# EAGLE design Hauptplatine (EAGLE 5.09)
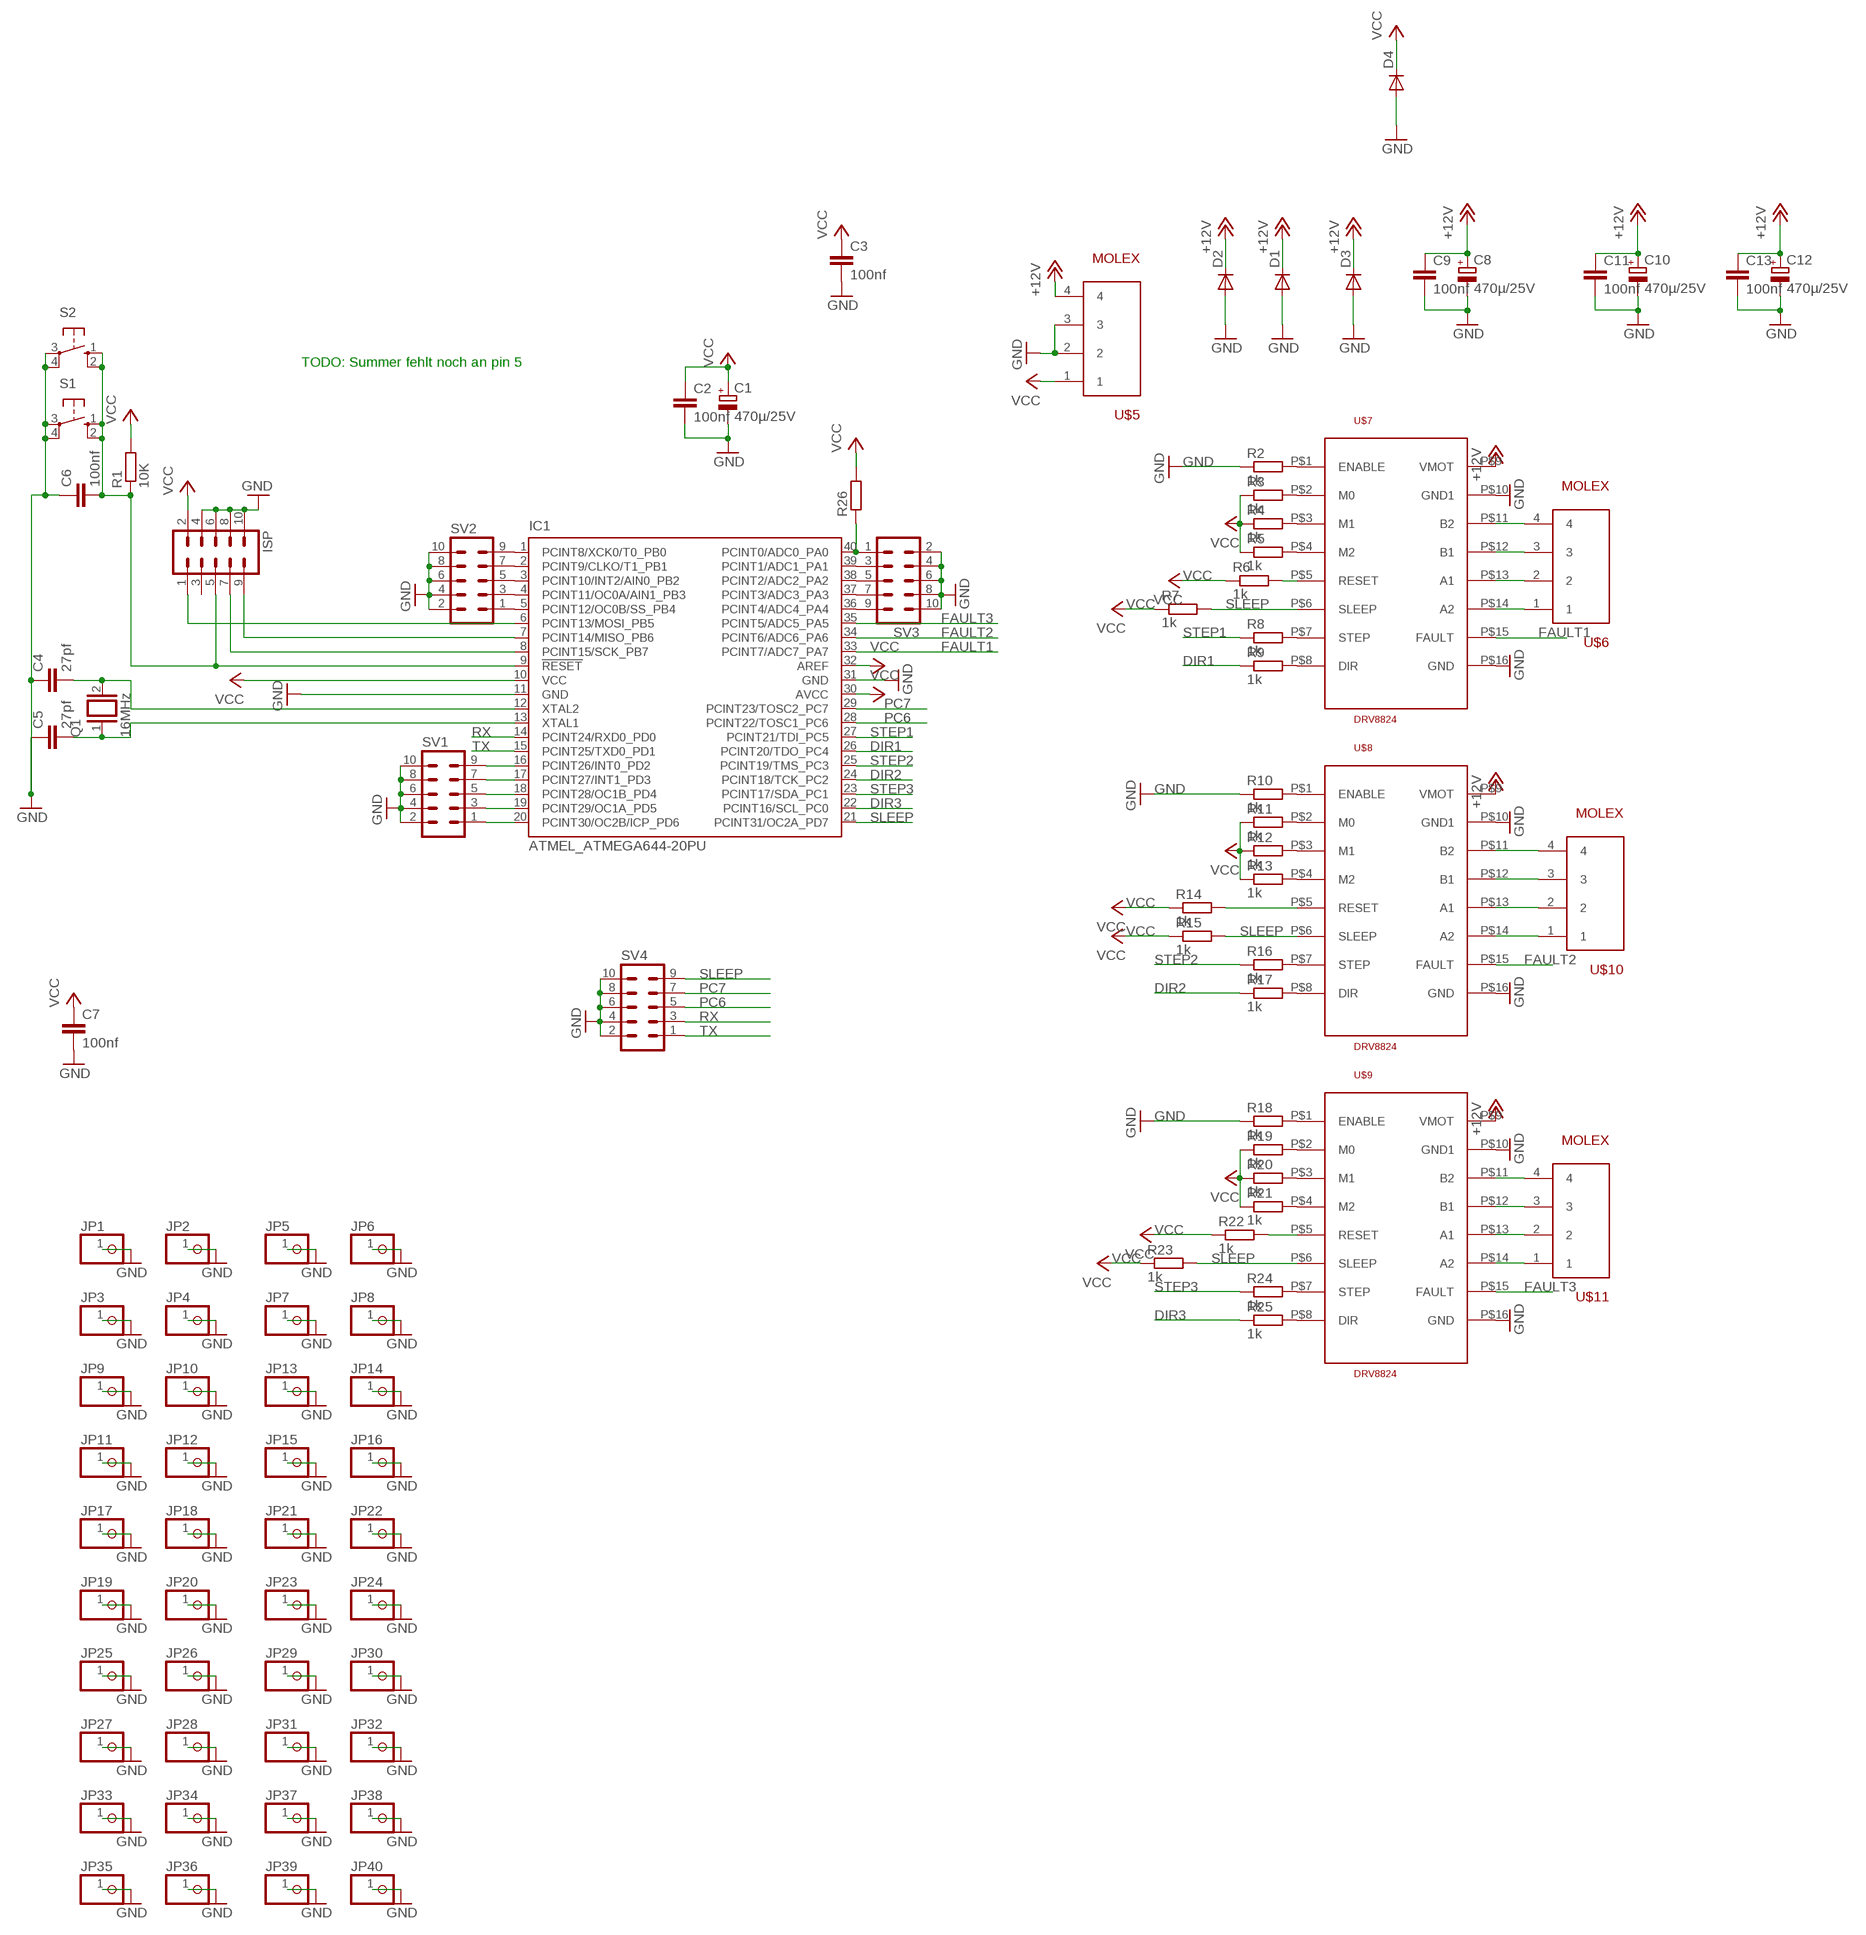
[diagram p0: schematic, sheet 1]

## Parts
C1  470µ/25V  RCL_CPOL-EUTT5D11  [RCL_TT5D11]
C2  100nf  C-EUC1206  [C1206]
C3  100nf  C-EUC1206  [C1206]
C4  27pf  C-EUC1206  [C1206]
C5  27pf  C-EUC1206  [C1206]
C6  100nf  C-EUC1206  [C1206]
C7  100nf  C-EUC1206  [C1206]
C8  470µ/25V  RCL_CPOL-EUTT5D11  [RCL_TT5D11]
C9  100nf  C-EUC1206  [C1206]
C10  470µ/25V  RCL_CPOL-EUTT5D11  [RCL_TT5D11]
C11  100nf  C-EUC1206  [C1206]
C12  470µ/25V  RCL_CPOL-EUTT5D11  [RCL_TT5D11]
C13  100nf  C-EUC1206  [C1206]
D1  DIODE-DO214AA  [DO214AA]
D2  DIODE-DO214AA  [DO214AA]
D3  DIODE-DO214AA  [DO214AA]
D4  DIODE-DO214AA  [DO214AA]
IC1  ATMEL_ATMEGA644-20PU  [ATMEL_DIL40]
ISP  CON-HARTING-ML_ML10  [CON-HARTING-ML_ML10]
JP1  PINHD-1X1  [1X01]
JP2  PINHD-1X1  [1X01]
JP3  PINHD-1X1  [1X01]
JP4  PINHD-1X1  [1X01]
JP5  PINHD-1X1  [1X01]
JP6  PINHD-1X1  [1X01]
JP7  PINHD-1X1  [1X01]
JP8  PINHD-1X1  [1X01]
JP9  PINHD-1X1  [1X01]
JP10  PINHD-1X1  [1X01]
JP11  PINHD-1X1  [1X01]
JP12  PINHD-1X1  [1X01]
JP13  PINHD-1X1  [1X01]
JP14  PINHD-1X1  [1X01]
JP15  PINHD-1X1  [1X01]
JP16  PINHD-1X1  [1X01]
JP17  PINHD-1X1  [1X01]
JP18  PINHD-1X1  [1X01]
JP19  PINHD-1X1  [1X01]
JP20  PINHD-1X1  [1X01]
JP21  PINHD-1X1  [1X01]
JP22  PINHD-1X1  [1X01]
JP23  PINHD-1X1  [1X01]
JP24  PINHD-1X1  [1X01]
JP25  PINHD-1X1  [1X01]
JP26  PINHD-1X1  [1X01]
JP27  PINHD-1X1  [1X01]
JP28  PINHD-1X1  [1X01]
JP29  PINHD-1X1  [1X01]
JP30  PINHD-1X1  [1X01]
JP31  PINHD-1X1  [1X01]
JP32  PINHD-1X1  [1X01]
JP33  PINHD-1X1  [1X01]
JP34  PINHD-1X1  [1X01]
JP35  PINHD-1X1  [1X01]
JP36  PINHD-1X1  [1X01]
JP37  PINHD-1X1  [1X01]
JP38  PINHD-1X1  [1X01]
JP39  PINHD-1X1  [1X01]
JP40  PINHD-1X1  [1X01]
Q1  16MHz  XTAL/S  [QS]
R1  10K  R-EU_R1206  [R1206]
R2  1k  R-EU_R1206  [R1206]
R3  1k  R-EU_R1206  [R1206]
R4  1k  R-EU_R1206  [R1206]
R5  1k  R-EU_R1206  [R1206]
R6  1k  R-EU_R1206  [R1206]
R7  1k  R-EU_R1206  [R1206]
R8  1k  R-EU_R1206  [R1206]
R9  1k  R-EU_R1206  [R1206]
R10  1k  R-EU_R1206  [R1206]
R11  1k  R-EU_R1206  [R1206]
R12  1k  R-EU_R1206  [R1206]
R13  1k  R-EU_R1206  [R1206]
R14  1k  R-EU_R1206  [R1206]
R15  1k  R-EU_R1206  [R1206]
R16  1k  R-EU_R1206  [R1206]
R17  1k  R-EU_R1206  [R1206]
R18  1k  R-EU_R1206  [R1206]
R19  1k  R-EU_R1206  [R1206]
R20  1k  R-EU_R1206  [R1206]
R21  1k  R-EU_R1206  [R1206]
R22  1k  R-EU_R1206  [R1206]
R23  1k  R-EU_R1206  [R1206]
R24  1k  R-EU_R1206  [R1206]
R25  1k  R-EU_R1206  [R1206]
R26  R-EU_R1206  [R1206]
S1  10-XX  [B3F-10XX]
S2  10-XX  [B3F-10XX]
SV1  CON-HARTING-ML_ML10  [CON-HARTING-ML_ML10]
SV2  CON-HARTING-ML_ML10  [CON-HARTING-ML_ML10]
SV3  CON-HARTING-ML_ML10  [CON-HARTING-ML_ML10]
SV4  CON-HARTING-ML_ML10  [CON-HARTING-ML_ML10]
U$5  MOLEX  [MOLEX]
U$6  MOLEX  [MOLEX]
U$7  DRV8824  [POLOLU]
U$8  DRV8824  [POLOLU]
U$9  DRV8824  [POLOLU]
U$10  MOLEX  [MOLEX]
U$11  MOLEX  [MOLEX]

## Nets
+12V: C8.+ C9.1 C10.+ C11.1 C12.+ C13.1 D1.C D2.C D3.C U$5.4 U$7.P$9(VMOT) U$8.P$9(VMOT) U$9.P$9(VMOT)
DIR1: IC1.26(PCINT20/TDO_PC4) R9.1
DIR2: IC1.24(PCINT18/TCK_PC2) R17.1
DIR3: IC1.22(PCINT16/SCL_PC0) R25.1
FAULT1: IC1.33(PCINT7/ADC7_PA7) U$7.P$15(FAULT)
FAULT2: IC1.34(PCINT6/ADC6_PA6) U$8.P$15(FAULT)
FAULT3: IC1.35(PCINT5/ADC5_PA5) U$9.P$15(FAULT)
GND: C1.- C2.2 C3.2 C4.1 C5.1 C6.1 C7.2 C8.- C9.2 C10.- C11.2 C12.- C13.2 D1.A D2.A D3.A D4.A IC1.11(GND) IC1.31(GND) ISP.4 ISP.6 ISP.8 ISP.10 JP1.1 JP2.1 JP3.1 JP4.1 JP5.1 JP6.1 JP7.1 JP8.1 JP9.1 JP10.1 JP11.1 JP12.1 JP13.1 JP14.1 JP15.1 JP16.1 JP17.1 JP18.1 JP19.1 JP20.1 JP21.1 JP22.1 JP23.1 JP24.1 JP25.1 JP26.1 JP27.1 JP28.1 JP29.1 JP30.1 JP31.1 JP32.1 JP33.1 JP34.1 JP35.1 JP36.1 JP37.1 JP38.1 JP39.1 JP40.1 R2.1 R10.1 R18.1 S1.3(P) S1.4(P1) S2.3(P) S2.4(P1) SV1.2 SV1.4 SV1.6 SV1.8 SV1.10 SV2.2 SV2.4 SV2.6 SV2.8 SV2.10 SV3.2 SV3.4 SV3.6 SV3.8 SV3.10 SV4.2 SV4.4 SV4.6 SV4.8 SV4.10 U$5.2 U$5.3 U$7.P$10(GND1) U$7.P$16(GND) U$8.P$10(GND1) U$8.P$16(GND) U$9.P$10(GND1) U$9.P$16(GND)
N$1: U$6.1 U$7.P$14(A2)
N$2: U$6.2 U$7.P$13(A1)
N$3: U$6.3 U$7.P$12(B1)
N$4: U$6.4 U$7.P$11(B2)
N$5: IC1.6(PCINT13/MOSI_PB5) ISP.1
N$7: IC1.7(PCINT14/MISO_PB6) ISP.9
N$8: U$8.P$14(A2) U$10.1
N$9: C4.2 IC1.12(XTAL2) Q1.2
N$10: C5.2 IC1.13(XTAL1) Q1.1
N$11: U$8.P$13(A1) U$10.2
N$12: U$8.P$12(B1) U$10.3
N$13: U$8.P$11(B2) U$10.4
N$14: U$9.P$14(A2) U$11.1
N$15: U$9.P$13(A1) U$11.2
N$16: U$9.P$12(B1) U$11.3
N$17: U$9.P$11(B2) U$11.4
N$18: IC1.8(PCINT15/SCK_PB7) ISP.7
N$19: R2.2 U$7.P$1(ENABLE)
N$20: R3.2 U$7.P$2(M0)
N$21: R4.2 U$7.P$3(M1)
N$22: R5.2 U$7.P$4(M2)
N$23: R6.2 U$7.P$5(RESET)
N$25: R8.2 U$7.P$7(STEP)
N$26: R9.2 U$7.P$8(DIR)
N$27: IC1.20(PCINT30/OC2B/ICP_PD6) SV1.1
N$28: IC1.19(PCINT29/OC1A_PD5) SV1.3
N$29: IC1.18(PCINT28/OC1B_PD4) SV1.5
N$30: R10.2 U$8.P$1(ENABLE)
N$31: R11.2 U$8.P$2(M0)
N$32: R12.2 U$8.P$3(M1)
N$33: R13.2 U$8.P$4(M2)
N$34: R14.2 U$8.P$5(RESET)
N$36: R16.2 U$8.P$7(STEP)
N$37: R17.2 U$8.P$8(DIR)
N$38: R18.2 U$9.P$1(ENABLE)
N$39: R19.2 U$9.P$2(M0)
N$40: R20.2 U$9.P$3(M1)
N$41: R21.2 U$9.P$4(M2)
N$42: R22.2 U$9.P$5(RESET)
N$44: R24.2 U$9.P$7(STEP)
N$45: R25.2 U$9.P$8(DIR)
N$46: IC1.17(PCINT27/INT1_PD3) SV1.7
N$47: IC1.16(PCINT26/INT0_PD2) SV1.9
N$48: IC1.5(PCINT12/OC0B/SS_PB4) SV2.1
N$49: IC1.4(PCINT11/OC0A/AIN1_PB3) SV2.3
N$50: IC1.3(PCINT10/INT2/AIN0_PB2) SV2.5
N$51: IC1.2(PCINT9/CLKO/T1_PB1) SV2.7
N$52: IC1.1(PCINT8/XCK0/T0_PB0) SV2.9
N$53: IC1.40(PCINT0/ADC0_PA0) R26.1 SV3.1
N$54: IC1.39(PCINT1/ADC1_PA1) SV3.3
N$55: IC1.38(PCINT2/ADC2_PA2) SV3.5
N$56: IC1.37(PCINT3/ADC3_PA3) SV3.7
N$57: IC1.36(PCINT4/ADC4_PA4) SV3.9
N$62: C6.2 IC1.9(!RESET) ISP.5 R1.1 S1.1(S) S1.2(S1) S2.1(S) S2.2(S1)
PC6: IC1.28(PCINT22/TOSC1_PC6) SV4.5
PC7: IC1.29(PCINT23/TOSC2_PC7) SV4.7
RX: IC1.14(PCINT24/RXD0_PD0) SV4.3
SLEEP: IC1.21(PCINT31/OC2A_PD7) R7.2 R15.2 R23.2 SV4.9 U$7.P$6(SLEEP) U$8.P$6(SLEEP) U$9.P$6(SLEEP)
STEP1: IC1.27(PCINT21/TDI_PC5) R8.1
STEP2: IC1.25(PCINT19/TMS_PC3) R16.1
STEP3: IC1.23(PCINT17/SDA_PC1) R24.1
TX: IC1.15(PCINT25/TXD0_PD1) SV4.1
VCC: C1.+ C2.1 C3.1 C7.1 D4.C IC1.10(VCC) IC1.30(AVCC) IC1.32(AREF) ISP.2 R1.2 R3.1 R4.1 R5.1 R6.1 R7.1 R11.1 R12.1 R13.1 R14.1 R15.1 R19.1 R20.1 R21.1 R22.1 R23.1 R26.2 U$5.1
Unconnected: ISP.3

## Notes on the sheet
- TODO: Summer fehlt noch an pin 5

## Library data of the parts
C1 C8 C10 C12 = laser-tisch:RCL_CPOL-EU: POLARIZED CAPACITOR, European symbol
C2-C7 C9 C11 C13 = rcl:C-EU: CAPACITOR, European symbol
D1-D4 = diode:DIODE-: DIODE
IC1 = laser-tisch:ATMEL_ATMEGA644-*PU: 8-bit Microcontroller with 64K Bytes In-System Programmable Flash Auto generated by make-symbol-device-package-bsdl.ulp Rev. 34 Source: http://www.atmel.com/dyn/resources/prod_documents/doc2593.pdf
ISP SV1-SV4 = laser-tisch:CON-HARTING-ML_ML10: HARTING
JP1-JP40 = pinhead:PINHD-1X1: PIN HEADER
Q1 = special:XTAL/S: CRYSTAL
R1-R26 = rcl:R-EU_: RESISTOR, European symbol
S1 S2 = switch-omron:10-XX: OMRON SWITCH
U$5 U$6 U$10 U$11 = molex:MOLEX
U$7-U$9 = drv8824:DRV8824

## Board
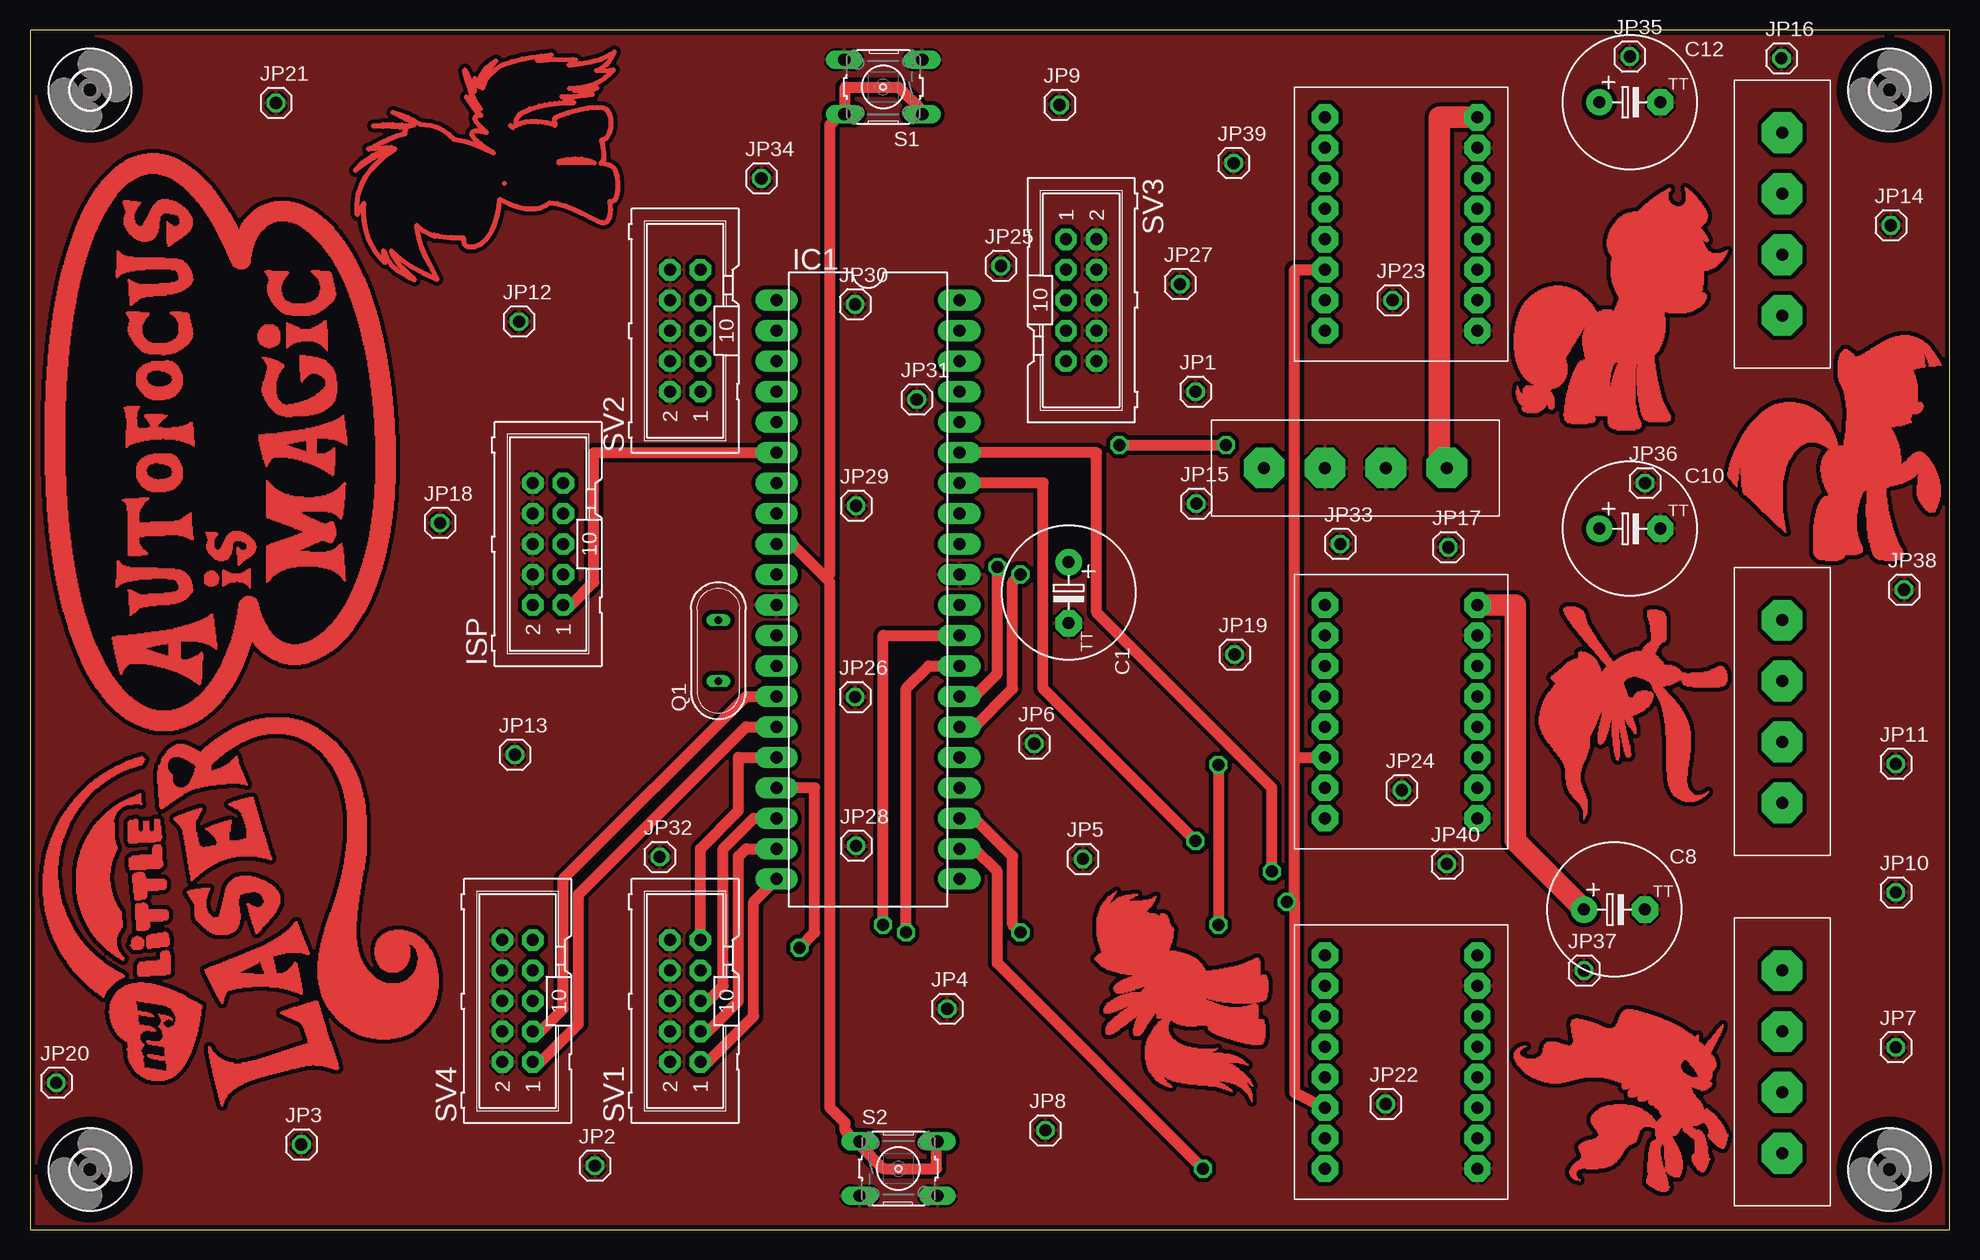
[diagram p1: board, top side]
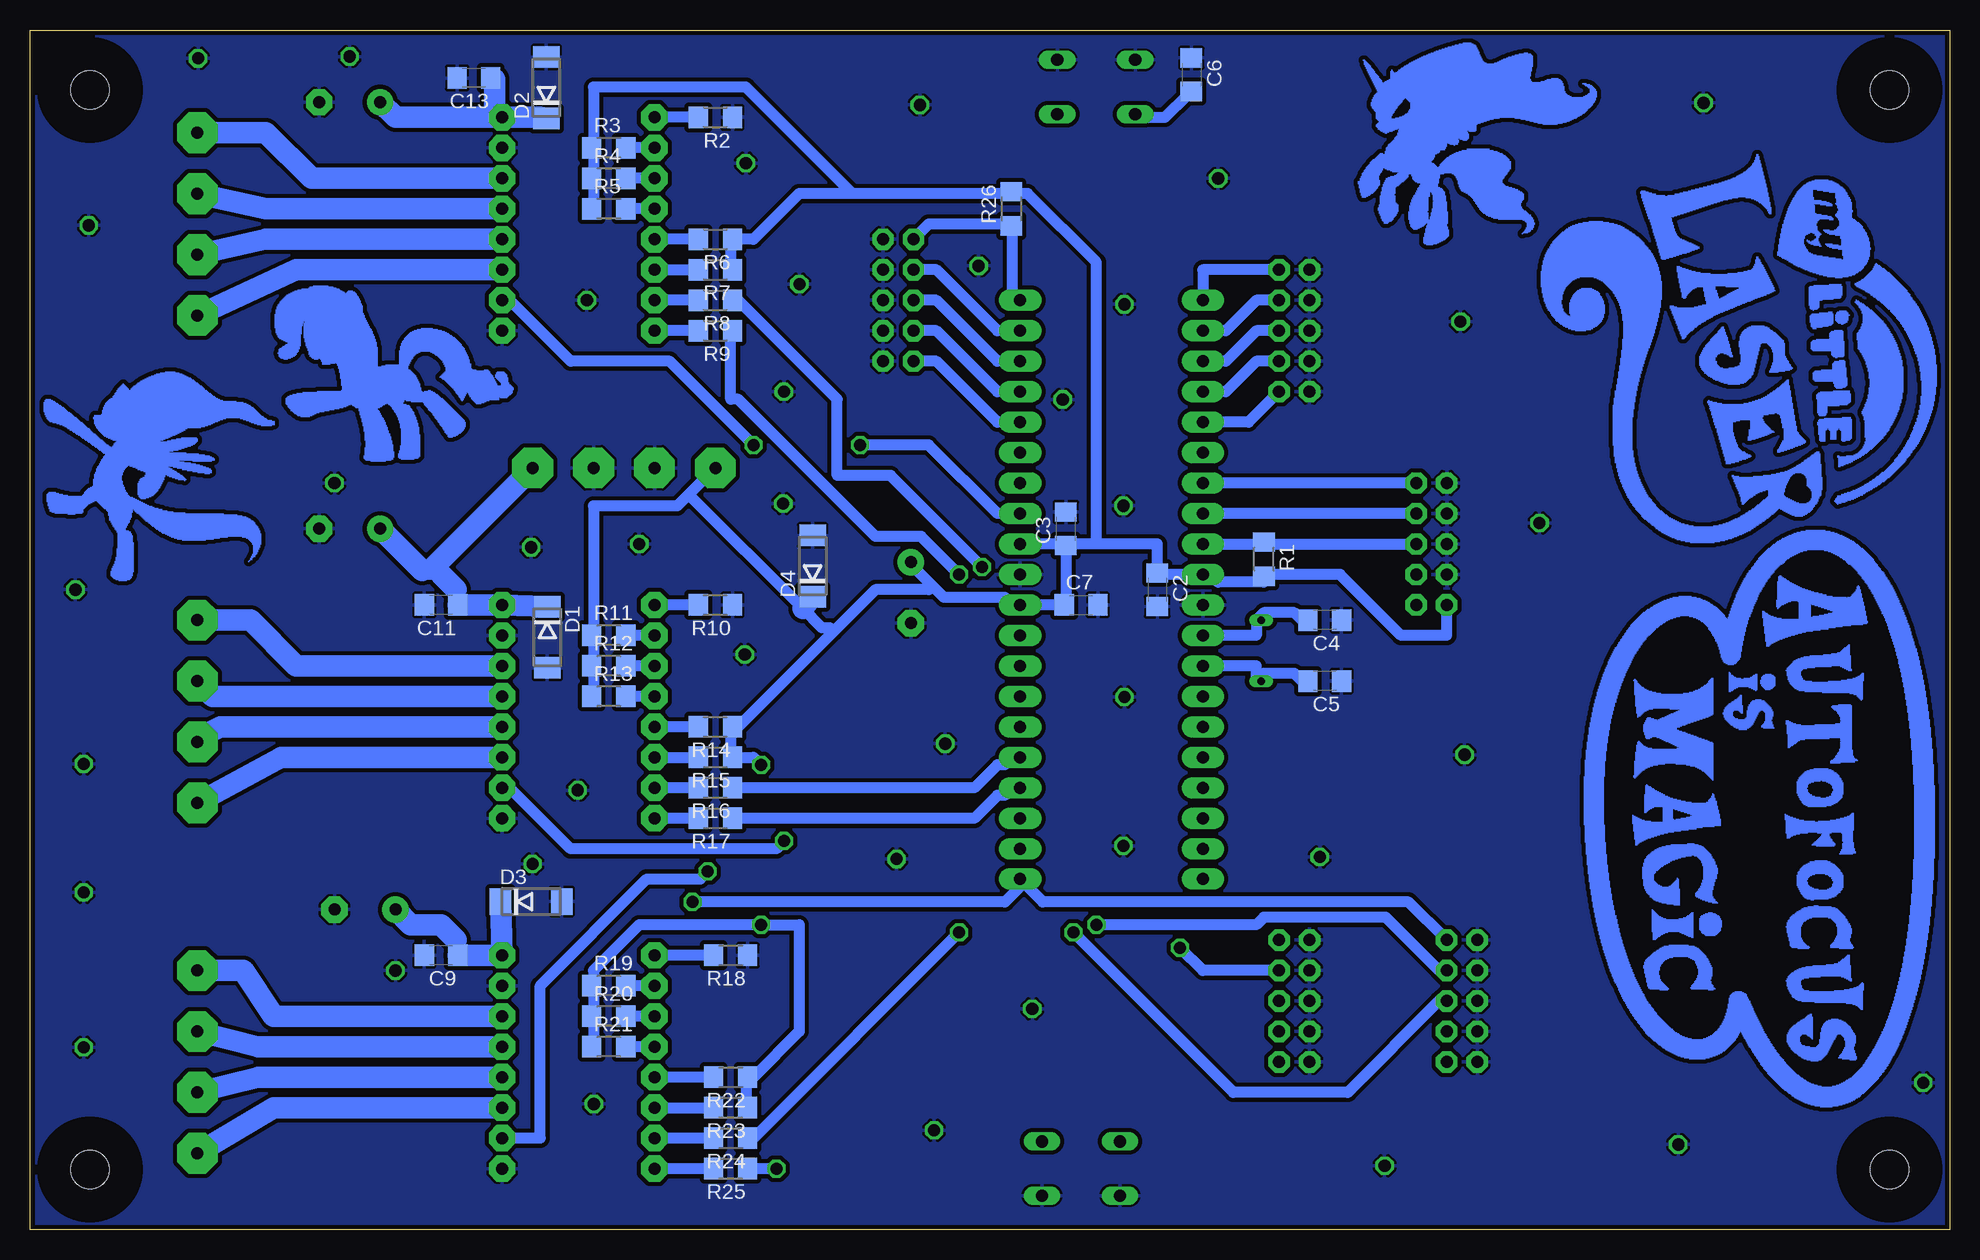
[diagram p2: board, bottom side, seen from below]

Size 160 x 100 mm. Coordinates in mm from the lower left corner, seen from the top.
Outline: 0,0 160,0 160,100 0,100 0,0
Copper layers (1*16): Top 0.035mm / dielectric 1.5mm / Bottom 0.035mm
Design rules "pcb-devboards_35ÂµmCU_200Âµm_Strukturen_Abstaende": minimum track width 0.2mm, minimum drill 0.3mm, track to track 0.2mm, track to pad 0.2mm, pad to pad 0.2mm, via to via 0.2mm, smd to smd 0.2mm, copper to edge 0.4mm, drill to drill 0.4mm, minimum pad ring 0.2mm, minimum via ring 0.2mm, stop-mask expansion 4mil, vias tented up to drill 0mil, thermal gap 0.2mm

### Footprints (pad centres in the part's own frame; a part is rotated, then mirrored left to right if it is on the bottom)
RCL_TT5D11 = drill 1 pad 2.184 round: + -2.54,0 | drill 1 pad 2.184 octagon: - 2.54,0
C1206 = smd 1.6 x 1.8: 1 -1.4,0; 2 1.4,0
DO214AA = smd 1.8 x 2.2: A 2.55,0; C -2.55,0
ATMEL_DIL40 = drill 1 pad 1.778 long: 1 -24.13,-7.62; 2 -21.59,-7.62; 3 -19.05,-7.62; 4 -16.51,-7.62; 5 -13.97,-7.62; 6 -11.43,-7.62; 7 -8.89,-7.62; 8 -6.35,-7.62; 9 -3.81,-7.62; 10 -1.27,-7.62; 11 1.27,-7.62; 12 3.81,-7.62; 13 6.35,-7.62; 14 8.89,-7.62; 15 11.43,-7.62; 16 13.97,-7.62; 17 16.51,-7.62; 18 19.05,-7.62; 19 21.59,-7.62; 20 24.13,-7.62; 21 24.13,7.62; 22 21.59,7.62; 23 19.05,7.62; 24 16.51,7.62; 25 13.97,7.62; 26 11.43,7.62; 27 8.89,7.62; 28 6.35,7.62; 29 3.81,7.62; 30 1.27,7.62; 31 -1.27,7.62; 32 -3.81,7.62; 33 -6.35,7.62; 34 -8.89,7.62; 35 -11.43,7.62; 36 -13.97,7.62; 37 -16.51,7.62; 38 -19.05,7.62; 39 -21.59,7.62; 40 -24.13,7.62
CON-HARTING-ML_ML10 = drill 1 pad 1.778 octagon: 1 -5.08,-1.27; 2 -5.08,1.27; 3 -2.54,-1.27; 4 -2.54,1.27; 5 0,-1.27; 6 0,1.27; 7 2.54,-1.27; 8 2.54,1.27; 9 5.08,-1.27; 10 5.08,1.27
1X01 = drill 1.016 octagon: 1 0,0
QS = drill 0.61 long: 1 -2.54,0; 2 2.54,0
R1206 = smd 1.6 x 1.803: 1 -1.422,0; 2 1.422,0
B3F-10XX = drill 1.016 long: 1 -3.251,2.261; 2 3.251,2.261; 3 -3.251,-2.261; 4 3.251,-2.261
3,2 = hole 3.2: 0,0
MOLEX = drill 1 pad 3.396 octagon: 1 -7.62,0; 2 -2.54,0; 3 2.54,0; 4 7.62,0
POLOLU = drill 1 pad 2.184 octagon: P$1 -6.35,8.89; P$2 -6.35,6.35; P$3 -6.35,3.81; P$4 -6.35,1.27; P$5 -6.35,-1.27; P$6 -6.35,-3.81; P$7 -6.35,-6.35; P$8 -6.35,-8.89; P$9 6.35,8.89; P$10 6.35,6.35; P$11 6.35,3.81; P$12 6.35,1.27; P$13 6.35,-1.27; P$14 6.35,-3.81; P$15 6.35,-6.35; P$16 6.35,-8.89

### Placement (x,y rotation side)
C1  86.58,53.09 270 top
C2  66.04,53.34 270 bottom
C3  73.66,58.42 90 bottom
C4  52.07,50.8 180 bottom
C5  52.07,45.72 180 bottom
C6  63.2,96.27 270 bottom
C7  72.39,52.07 0 bottom
C8  132.08,26.67 0 top
C9  125.73,22.86 180 bottom
C10  133.35,58.42 0 top
C11  125.73,52.07 180 bottom
C12  133.35,93.98 0 top
C13  123,96 180 bottom
D1  116.88,49.37 270 bottom
D2  116.96,95.19 90 bottom
D3  118.23,27.34 0 bottom
D4  94.77,55.31 90 bottom
IC1  69.85,53.34 270 top
ISP  43.18,57.15 90 top
JP1  97.16,69.85 0 top
JP2  47.09,5.32 0 top
JP3  22.62,7.09 0 top
JP4  76.46,18.4 0 top
JP5  87.76,30.89 0 top
JP6  83.71,40.51 0 top
JP7  155.53,15.19 0 top
JP8  84.64,8.27 0 top
JP9  85.82,93.76 0 top
JP10  155.53,28.1 0 top
JP11  155.53,38.82 0 top
JP12  40.76,75.7 0 top
JP13  40.42,39.58 0 top
JP14  155.11,83.71 0 top
JP15  97.22,60.51 0 top
JP16  145.99,97.64 0 top
JP17  118.23,56.88 0 top
JP18  34.18,58.9 0 top
JP19  100.42,47.93 0 top
JP20  2.19,12.24 0 top
JP21  20.51,93.92 0 top
JP22  113,10.46 0 top
JP23  113.59,77.47 0 top
JP24  114.35,36.62 0 top
JP25  80.93,80.34 0 top
JP26  68.78,44.39 0 top
JP27  95.86,78.82 0 top
JP28  68.86,31.98 0 top
JP29  68.86,60.34 0 top
JP30  68.78,77.13 0 top
JP31  73.92,69.2 0 top
JP32  52.49,31.05 0 top
JP33  109.22,57.15 0 top
JP34  60.96,87.63 0 top
JP35  133.35,97.79 0 top
JP36  134.62,62.23 0 top
JP37  129.54,21.59 0 top
JP38  156.21,53.34 0 top
JP39  100.33,88.9 0 top
JP40  118.11,30.48 0 top
Q1  57.37,48.26 90 top
R1  57.15,55.88 270 bottom
R2  102.87,92.71 180 bottom
R3  111.76,90.17 0 bottom
R4  111.76,87.63 0 bottom
R5  111.76,85.09 0 bottom
R6  102.87,82.55 180 bottom
R7  102.87,80.01 180 bottom
R8  102.87,77.47 180 bottom
R9  102.87,74.93 180 bottom
R10  102.87,52.07 180 bottom
R11  111.76,49.53 0 bottom
R12  111.76,46.99 0 bottom
R13  111.76,44.45 0 bottom
R14  102.87,41.91 180 bottom
R15  102.87,39.37 180 bottom
R16  102.87,36.83 180 bottom
R17  102.87,34.29 180 bottom
R18  101.6,22.86 180 bottom
R19  111.76,20.32 0 bottom
R20  111.76,17.78 0 bottom
R21  111.76,15.24 0 bottom
R22  101.6,12.7 180 bottom
R23  101.6,10.16 180 bottom
R24  101.6,7.62 180 bottom
R25  101.6,5.08 180 bottom
R26  78.2,85.09 90 bottom
S1  71.12,95.25 180 top
S2  72.39,5.08 0 top
SV1  54.61,19.05 90 top
SV2  54.61,74.93 90 top
SV3  87.63,77.47 270 top
SV4  40.64,19.05 90 top
U$1  [3,2]  5,95 0 top
U$2  [3,2]  155,95 0 top
U$3  [3,2]  155,5 0 top
U$4  [3,2]  5,5 0 top
U$5  110.49,63.5 0 top
U$6  146.05,83.82 90 top
U$7  114.3,83.82 0 top
U$8  114.3,43.18 0 top
U$9  114.3,13.97 0 top
U$10  146.05,43.18 90 top
U$11  146.05,13.97 90 top

### Tracks (layer width: path | path; a pad name or v marks a point on that pad's centre or on a via)
+12V
  Top 0.914: 121.28,52.07 U$8.P$9
  Top 1.778: C8.+ 123.83,32.38 123.83,52.07 121.28,52.07 | U$7.P$9 117.47,92.71 117.47,64.14 U$5.4
  Bottom 0.914: 121.28,95.89 C13.1 | U$7.P$9 121.28,92.71 | 124.46,24.13 124.46,22.86 C9.1 | 125.73,54.61 127,54.61 127.32,54.93 127,55.24 126.36,55.24 | 124.46,53.34 124.46,52.07 C11.1
  Bottom 1.778: 121.28,95.89 121.28,92.71 129.54,92.71 C12.+ | C9.1 U$9.P$9 D3.C | C8.+ 128.27,25.4 125.73,25.4 124.46,24.13 | C11.1 U$8.P$9 D1.C | 127.32,54.93 C10.+ | 124.46,53.34 125.73,54.61 | 126.36,55.24 U$5.4 | D2.C 117.47,92.71 U$7.P$9
DIR1  (via drill 1)
  Top 0.914: v82.55,54.61 81.92,53.98 81.92,45.09 78.74,41.91 IC1.26
  Bottom 0.914: v82.55,54.61 85.72,57.78 89.53,57.78 100.97,69.22 101.6,69.22 101.6,74.93 R9.1
DIR2
  Bottom 0.914: IC1.24 78.11,36.83 78.74,36.2 79.38,36.2 81.28,34.29 R17.1
DIR3  (via drill 1)
  Top 0.914: v97.79,5.08 80.64,22.23 80.64,29.84 78.74,31.75 IC1.22
  Bottom 0.914: v97.79,5.08 R25.1
FAULT1  (via drill 1)
  Top 0.914: v90.81,65.41 v99.69,65.41
  Bottom 0.914: IC1.33 79.38,59.69 85.09,65.41 v90.81,65.41 | v99.69,65.41 106.68,72.39 114.94,72.39 120.02,77.47 U$7.P$15
FAULT2  (via drill 1)
  Top 0.914: IC1.34 84.45,62.23 84.45,45.09 v97.16,32.38
  Bottom 0.914: v97.16,32.38 97.79,31.75 114.94,31.75 120.02,36.83 U$8.P$15
FAULT3  (via drill 1)
  Top 0.914: IC1.35 88.9,64.77 88.9,51.44 103.5,36.83 v103.5,29.84
  Bottom 0.914: v103.5,29.84 104.14,29.21 108.58,29.21 117.47,20.32 117.47,7.62 U$9.P$15
GND
  pour Bottom (isolate 0.35): 0,100 0,0 159.82,0 160,100
  pour Top (isolate 0.35): 0,100 0,0 159.82,0 160,100
N$1
  Bottom 1.778: U$7.P$14 137.79,80.01 U$6.1
N$2
  Bottom 1.778: U$7.P$13 140.34,82.55 U$6.2
N$3
  Bottom 1.778: U$7.P$12 140.34,85.09 U$6.3
N$4
  Bottom 1.778: U$7.P$11 127,87.63 136.53,87.63 140.34,91.44 U$6.4
N$5
  Top 0.914: IC1.6 46.99,64.77 46.99,53.98 45.09,52.07 ISP.1
N$6
  Top 0.4: 27.14,88.31 27.78,88.99 28.55,89.53 29.36,89.92 30.12,90.2 28.79,90.11 28.21,90.06 28.73,90.31 29.29,90.6 29.91,90.91 30.57,91.19 31.25,91.35 31.23,91.49 31.25,91.61 31.3,91.73 31.38,91.83 30.84,91.89 30.16,91.94 29.41,91.97 28.62,91.98 29.45,92.11 30.25,92.12 31,92.06 31.66,92 32.06,92.12 31.73,92.33 31.37,92.55 30.89,92.8 30.23,93.14 30.9,92.92 31.49,92.7 32.01,92.44 32.5,92.15 32.47,92.15 33.41,92.06 33.95,91.89 34.46,91.62 34.94,91.27 35.35,90.88 36.26,90.72 37.13,90.45 37.93,90.11 38.63,89.76 38.21,90.03 37.84,90.29 37.53,90.52 37.3,90.7 37.03,90.95 36.88,91.16 36.84,91.26 36.83,91.27 36.83,91.28 36.83,91.36 36.87,91.45 36.94,91.52 37.11,91.58 37.32,91.59 37.57,91.56 37.84,91.51 38.06,91.44 37.77,91.7 37.54,91.93 37.35,92.14 37.23,92.31 37.11,92.53 37.11,92.73 37.17,92.81 37.24,92.87 37.43,92.9 37.6,92.88 37.4,93.05 37.2,93.25 37.01,93.48 36.84,93.71 36.68,93.94 36.55,94.14 36.45,94.31 36.39,94.43 36.73,94.09 37.04,93.81 37.32,93.58 37.52,93.4 37.41,93.62 37.21,93.91 37,94.33 36.79,94.82 36.6,95.34 36.43,95.83 36.31,96.25 36.25,96.55 36.25,96.68 37.05,94.87 37.02,95.16 37.05,95.59 37.09,95.97 37.25,95.62 37.41,95.31 37.43,95.51 37.48,95.75 37.56,96.02 37.69,96.3 37.87,96.59 38.11,96.88 38.43,97.16 38.83,97.42 38.34,96.8 38.01,96.21 37.81,95.66 37.72,95.15 37.97,95.8 38.35,96.33 38.84,96.76 39.42,97.08 40.18,97.37 40.99,97.58 41.81,97.72 42.6,97.82 43.47,97.92 42.65,97.61 42.42,97.51 42.29,97.44 43.72,97.55 45.24,97.53 45.49,97.52 45.31,97.34 45.11,97.19 44.9,97.07 45.83,97.19 46.74,97.34 47.59,97.58 48.35,97.94 48.71,98.18 48.5,97.8 48.25,97.39 47.98,97.08 47.65,96.83 47.23,96.61 48.32,96.63 48.64,96.67 48.41,96.44 48.17,96.21 47.89,95.97 47.54,95.74 47.11,95.52 46.7,95.38 46.21,95.26 45.63,95.17 44.96,95.13 46.12,95.11 47.27,95.17 47,95.05 46.51,94.99 45.91,94.97 45.33,94.98 45.77,94.89 46.29,94.78 46.85,94.64 46.28,94.56 45.8,94.5 45.33,94.46 44.85,94.44 44.33,94.46 45.34,93.95 44.89,93.94 44.83,93.94 44.67,93.93 44.43,93.92 44.11,93.9 43.74,93.87 43.34,93.82 42.91,93.75 42.47,93.66 41.63,93.41 40.96,93.06 40.72,92.84 40.57,92.59 40.52,92.34 40.54,92.06 40.86,92.19 41.27,92.3 41.75,92.36 42.33,92.35 43,92.25 43.77,92.05 43.73,92.19 43.71,92.48 43.75,92.62 43.86,92.73 44.9,93.1 45.92,93.36 46.51,93.46 47.27,93.53 47.86,93.47 48.06,93.37 48.23,93.17 48.35,92.91 48.43,92.59 48.46,92.24 48.42,91.86 48.31,91.46 48.12,91.07 48,90.94 47.84,90.87 47.66,90.84 47.73,90.51 47.81,90.08 47.84,89.72 47.84,89.38 47.82,89.22 47.77,89.08 47.7,88.97 47.6,88.88 47.95,88.82 48.25,88.74 48.49,88.64 48.67,88.49 48.77,88.34 48.85,88.16 48.91,87.96 48.96,87.73 49.02,87.24 49.01,86.74 48.99,86.5 48.95,86.28 48.89,86.08 48.81,85.92 48.7,85.78 48.55,85.7 48.35,85.7 48.36,85.63 48.39,85.37 48.4,85.06 48.39,84.75 48.33,84.44 48.28,84.3 48.21,84.17 48.11,84.05 48,83.97 47.83,83.92 47.65,83.95 47.44,84.02 47.21,84.11 46.66,84.39 46.02,84.71 45.33,85.04 44.63,85.33 43.95,85.53 43.31,85.59 43.03,85.39 42.61,85.2 42.17,85.11 41.72,85.08 41.27,85.12 40.59,85.28 39.98,85.5 39.49,85.72 39.16,85.89 39.16,85.88 39.09,85.23 38.94,84.49 38.73,83.78 38.47,83.19 38.07,82.61 37.6,82.18 37.07,81.94 36.48,81.92 36.32,82 36.21,82.14 36.16,82.29 36.14,82.44 36.13,82.57 36.11,82.66 36.1,82.68 35.07,82.69 34.04,82.82 33.66,82.92 33.74,82.81 33.38,82.94 32.76,83.26 32.25,83.7 32.34,83.02 32.48,82.42 32.64,81.89 32.84,81.4 33.06,80.93 33.3,80.47 33.54,80 33.8,79.49 33.94,79.21 33.66,79.34 32.71,79.79 31.78,80.29 30.9,80.88 30.13,81.57 30.35,81.08 30.66,80.61 31.06,80.14 31.55,79.65 32.05,79.18 31.43,79.47 30.65,79.93 30.11,80.43 29.74,80.97 29.48,81.57 29.5,81.23 29.55,80.94 29.61,80.61 29.36,80.85 28.72,81.61 28.28,82.44 28.01,83.28 27.86,84.09 27.81,84.82 27.82,85.42 27.82,85.54 27.77,85.44 27.7,85.31 27.6,85.14 27.46,84.91 27.28,84.61 27.25,84.96 27.25,85.46 27.37,86.29 27.62,87.06 27.99,87.75 28.45,88.38 29.4,89.33 30.42,90.07 29.48,89.75 28.66,89.35 27.9,88.87 27.14,88.31
N$7
  Bottom 0.914: ISP.9 IC1.7
N$8
  Bottom 1.778: U$8.P$14 139.06,39.37 U$10.1
N$9
  Bottom 0.914: 57.78,50.8 57.15,51.44 54.61,51.44 53.98,50.8 C4.2 | IC1.12 57.78,49.53 57.78,50.8 | 57.78,50.8 Q1.2
N$10
  Top 0.914: Q1.1 57.78,45.72
  Bottom 0.914: 57.78,45.72 57.15,46.35 54.61,46.35 53.98,45.72 C5.2 | 57.78,45.72 Q1.1 | IC1.13 57.78,46.99 57.78,45.72
N$11
  Bottom 1.778: U$8.P$13 144.15,41.91 145.41,41.27 U$10.2
N$12
  Bottom 1.778: U$8.P$12 144.78,44.45 U$10.3
N$13
  Bottom 1.778: U$8.P$11 137.79,46.99 141.6,50.8 U$10.4
N$14
  Bottom 1.778: U$9.P$14 139.7,10.16 U$11.1
N$15
  Bottom 1.778: U$9.P$13 140.97,12.7 U$11.2
N$16
  Bottom 1.778: U$9.P$12 140.97,15.24 U$11.3
N$17
  Bottom 1.778: U$9.P$11 139.7,17.78 142.24,21.59 U$11.4
N$18
  Bottom 0.914: ISP.7 IC1.8
N$19
  Bottom 0.914: R2.2 U$7.P$1
N$20
  Bottom 0.914: U$7.P$2 R3.2
N$21
  Bottom 0.914: U$7.P$3 R4.2
N$22
  Bottom 0.914: U$7.P$4 R5.2
N$23
  Bottom 0.914: R6.2 U$7.P$5
N$24
  Top 0.4: 39.55,87.2 39.53,87.2
N$25
  Bottom 0.914: R8.2 U$7.P$7
N$26
  Bottom 0.914: R9.2 U$7.P$8
N$27
  Top 0.914: IC1.20 60.33,27.3 60.33,17.78 56.52,13.97 SV1.1
N$28
  Top 0.914: IC1.19 59.69,31.75 59.05,31.11 59.05,19.05 56.52,16.51 SV1.3
N$29
  Top 0.914: IC1.18 60.33,34.29 57.78,31.75 57.78,20.32 56.52,19.05 SV1.5
N$30
  Bottom 0.914: R10.2 U$8.P$1
N$31
  Bottom 0.914: U$8.P$2 R11.2
N$32
  Bottom 0.914: U$8.P$3 R12.2
N$33
  Bottom 0.914: U$8.P$4 R13.2
N$34
  Bottom 0.914: R14.2 U$8.P$5
N$35
  Top 0.4: 40.11,91.99 40.04,92.04 40.05,92.03 40.11,91.99
N$36
  Bottom 0.914: R16.2 U$8.P$7
N$37
  Bottom 0.914: R17.2 U$8.P$8
N$38
  Bottom 0.914: R18.2 U$9.P$1
N$39
  Bottom 0.914: U$9.P$2 R19.2
N$40
  Bottom 0.914: U$9.P$3 R20.2
N$41
  Bottom 0.914: U$9.P$4 R21.2
N$42
  Bottom 0.914: R22.2 U$9.P$5
N$43
  Top 0.4: 40.17,91.94 40.12,91.98
N$44
  Bottom 0.914: R24.2 U$9.P$7
N$45
  Bottom 0.914: R25.2 U$9.P$8
N$46  (via drill 1)
  Top 0.914: IC1.17 65.41,36.83 65.41,24.77 v64.14,23.5
  Bottom 0.914: v64.14,23.5 62.23,21.59 SV1.7
N$47
  Top 0.914: IC1.16 59.05,39.37 59.05,34.92 55.88,31.75 SV1.9
N$48
  Bottom 0.914: IC1.5 58.42,67.31 SV2.1
N$49
  Bottom 0.914: IC1.4 60.33,69.85 57.78,72.39 SV2.3
N$50
  Bottom 0.914: IC1.3 60.33,72.39 57.78,74.93 SV2.5
N$51
  Bottom 0.914: IC1.2 60.33,74.93 57.78,77.47 SV2.7
N$52
  Bottom 0.914: IC1.1 62.23,80.01 SV2.9
N$53
  Bottom 0.914: IC1.40 78.11,77.47 78.11,83.19 R26.1 78.74,83.82 85.09,83.82 SV3.1
N$54
  Bottom 0.914: IC1.39 79.38,74.93 84.45,80.01 SV3.3
N$55
  Bottom 0.914: IC1.38 79.38,72.39 84.45,77.47 SV3.5
N$56
  Bottom 0.914: IC1.37 79.38,69.85 84.45,74.93 SV3.7
N$57
  Bottom 0.914: IC1.36 79.38,67.31 84.45,72.39 SV3.9
N$58
  Top 0.4: 40.18,91.93 40.23,91.87 40.29,91.91 40.29,91.92 40.28,91.91 40.23,91.88 40.22,91.88 40.18,91.93
N$59
  Top 0.4: 44.08,89.02 44.1,88.93 44.94,88.98 45.94,88.98 47.05,88.94 46.77,89.04 46.44,89.14 46,89.23 45.46,89.26 44.83,89.2 44.08,89.02
N$62
  Top 0.914: S1.1 74.3,93.34 72.39,95.25 67.94,95.25 67.94,93.34 S1.2 67.31,92.71 66.67,92.08 66.67,54.61 66.36,54.29 | S2.2 75.56,6.99 75.56,5.08 71.12,5.08 69.22,6.99 S2.1 68.58,7.62 67.94,8.26 67.94,8.89 66.67,10.16 66.67,53.98 66.36,54.29 | 66.36,54.29 63.5,57.15 IC1.9
  Bottom 0.914: C6.2 63.5,94.61 65.41,92.71 67.31,92.71 S1.2 | IC1.9 57.15,57.15 | 57.15,57.15 ISP.5 | 57.15,57.15 R1.1
PC6  (via drill 1)
  Top 0.914: IC1.28 74.93,46.99 73.03,45.09 v73.03,24.77
  Bottom 0.914: v73.03,24.77 59.69,11.43 50.16,11.43 42.55,19.05 SV4.5
PC7  (via drill 1)
  Top 0.914: IC1.29 71.12,49.53 v71.12,25.4
  Bottom 0.914: v71.12,25.4 57.78,25.4 57.15,26.04 46.99,26.04 42.55,21.59 SV4.7
RX
  Top 0.914: IC1.14 59.69,44.45 44.45,29.21 44.45,18.41 42.55,16.51 SV4.3
SLEEP  (via drill 1)
  Top 0.914: 105.41,39.37 U$8.P$6 | 105.41,27.3 105.41,11.43 U$9.P$6 | 105.41,27.3 105.41,39.37 | U$7.P$6 105.41,80.01 105.41,39.37 | v104.78,27.3 105.41,27.3
  Bottom 0.914: 77.15,28.89 75.56,27.3 45.09,27.3 SV4.9 | 77.15,28.89 IC1.21 | U$7.P$6 R7.2 | U$8.P$6 R15.2 | U$9.P$6 R23.2 | v104.78,27.3 78.74,27.3 77.15,28.89
STEP1  (via drill 1)
  Top 0.914: v80.64,55.24 80.64,46.35 78.74,44.45 IC1.27
  Bottom 0.914: v80.64,55.24 88.27,62.87 92.71,62.87 92.71,69.22 100.97,77.47 R8.1
STEP2
  Bottom 0.914: IC1.25 78.11,39.37 78.74,38.73 79.38,38.73 81.28,36.83 R16.1
STEP3  (via drill 1)
  Top 0.914: v82.55,24.77 81.92,25.4 81.92,31.11 78.74,34.29 IC1.23
  Bottom 0.914: v82.55,24.77 99.69,7.62 R24.1
TX
  Top 0.914: IC1.15 59.69,41.91 45.72,27.94 45.72,17.14 42.55,13.97 SV4.1
VCC  (via drill 1)
  Top 0.914: v99.06,38.73 v99.06,25.4
  Bottom 0.914: 113.03,87.63 113.03,85.09 R5.1 | 113.03,90.17 113.03,87.63 | 113.03,87.63 R4.1 | R7.1 101.6,80.01 101.6,82.55 R6.1 99.69,82.55 95.89,86.36 91.44,86.36 | 91.44,86.36 78.74,86.36 R26.2 78.11,86.36 76.83,86.36 71.12,80.64 71.12,57.15 | 113.03,90.17 113.03,95.25 100.33,95.25 91.44,86.36 | 113.03,90.17 R3.1 | 113.03,46.99 113.03,44.45 R13.1 | 113.03,49.53 113.03,46.99 | 113.03,46.99 R12.1 | 113.03,49.53 113.03,60.33 106.05,60.33 105.09,61.28 | 105.09,61.28 U$5.1 | 113.03,49.53 R11.1 | R23.1 100.33,10.16 100.33,12.7 R22.1 99.69,12.7 95.89,16.51 95.89,25.4 v99.06,25.4 109.22,25.4 113.03,21.59 113.03,20.32 | 113.03,17.78 113.03,15.24 R21.1 | 113.03,20.32 113.03,17.78 | 113.03,17.78 R20.1 | 113.03,20.32 R19.1 | ISP.2 41.91,49.53 45.72,49.53 50.8,54.61 57.15,54.61 R1.2 57.15,53.98 60.96,53.98 61.59,54.61 IC1.10 66.04,54.61 C2.1 66.04,57.15 71.12,57.15 | 71.12,57.15 73.66,57.15 | 73.66,57.15 IC1.32 | 73.66,57.15 C3.1 73.66,52.07 C7.1 IC1.30 78.11,52.07 78.74,52.7 83.82,52.7 84.77,53.66 | 84.77,53.66 86.36,55.24 C1.+ | 93.03,49.85 89.53,53.34 85.09,53.34 84.77,53.66 | 93.03,49.85 100.97,41.91 R14.1 101.6,41.91 101.6,39.37 R15.1 99.69,39.37 v99.06,38.73 | 105.09,61.28 95.57,51.75 93.98,50.16 93.34,50.16 93.03,49.85
  Bottom 1.778: 95.57,51.75 D4.C
(copper drawn outside any net)
  shapes: Bottom area x5692, Top area x6712